# EAGLE schematic graphiclcd (EAGLE 4.16)
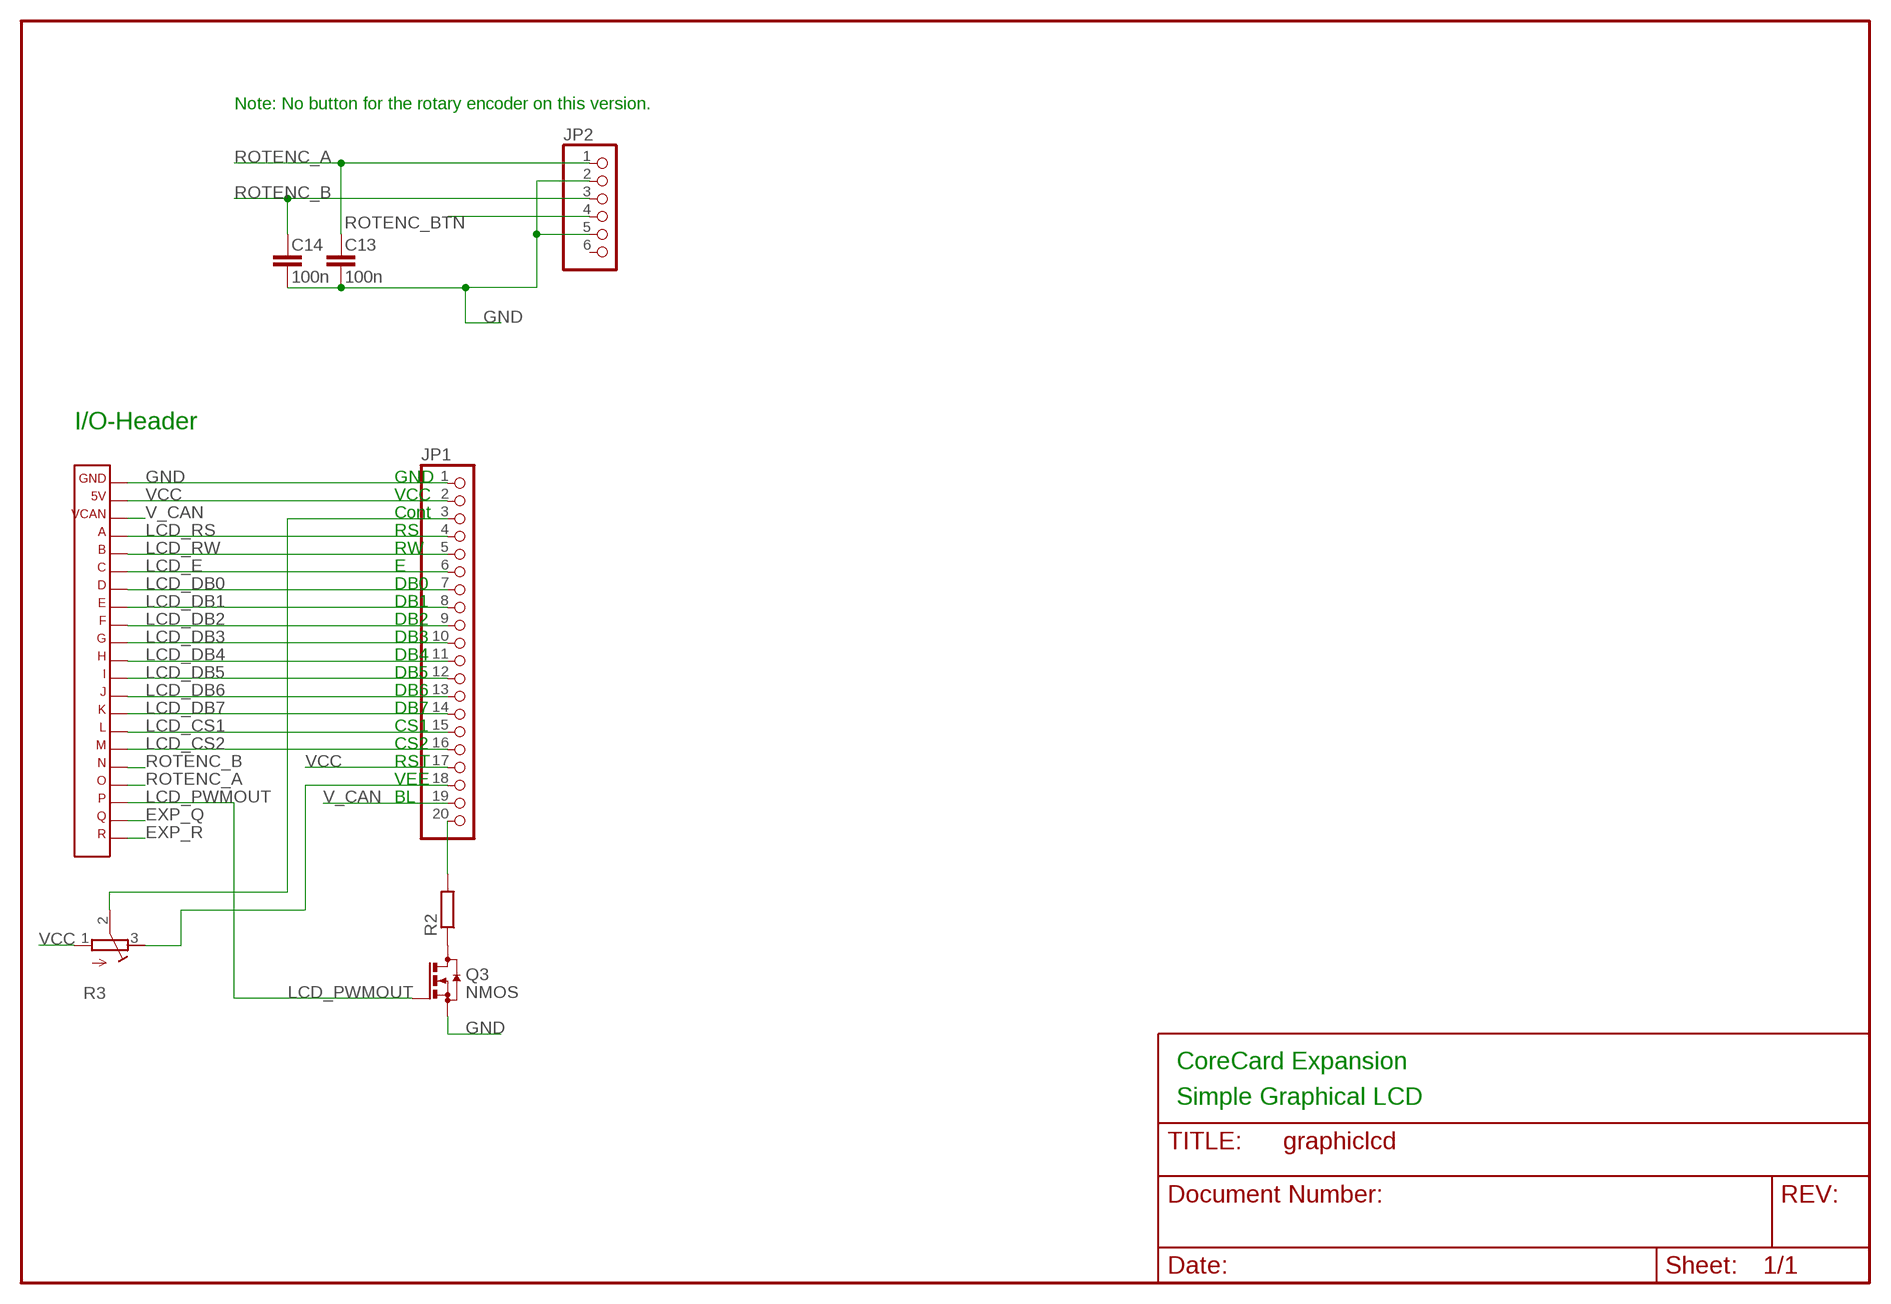
[diagram p0: schematic, sheet 1]

## Parts
C13  100n  C-EU  [C0603]
C14  100n  C-EU  [C0603]
JP1  PINHD-2X10  [2X10]
JP2  PINHD-2X03  [2X03]
Q3  NMOS  [SOT23]
R2  R-EU_0207/15  [0207/15]
R3  R-TRIM  [TRIM_PVZ3]
X3  CORE_IOHEADEXP  [CORE_IOHEAD_NOSILC]

## Nets
EXP_Q: X3.20
EXP_R: X3.21
GND: C13.2 C14.2 JP1.1 JP2.2 JP2.5 Q3.2(S) X3.1
LCD_CONTRAST: JP1.3 R3.2(PAD2)
LCD_CS1: JP1.15 X3.15
LCD_CS2: JP1.16 X3.16
LCD_DB0: JP1.7 X3.7
LCD_DB1: JP1.8 X3.8
LCD_DB2: JP1.9 X3.9
LCD_DB3: JP1.10 X3.10
LCD_DB4: JP1.11 X3.11
LCD_DB5: JP1.12 X3.12
LCD_DB6: JP1.13 X3.13
LCD_DB7: JP1.14 X3.14
LCD_E: JP1.6 X3.6
LCD_PWMOUT: Q3.1(G) X3.19
LCD_RS: JP1.4 X3.4
LCD_RW: JP1.5 X3.5
LCD_VEE: JP1.18 R3.3(PAD3)
N$1: Q3.3(D) R2.1
N$4: JP1.20 R2.2
ROTENC_A: C13.1 JP2.1 X3.18
ROTENC_B: C14.1 JP2.3 X3.17
ROTENC_BTN: JP2.4
V_CAN: JP1.19 X3.3
VCC: JP1.2 JP1.17 R3.1(PAD1) X3.2
Unconnected: JP2.6

## Notes on the sheet
- Note: No button for the rotary encoder on this version.
- I/O-Header
- GND
- VCC
- Cont
- RS
- RW
- E
- DB0
- DB1
- DB2
- DB3
- DB4
- DB5
- DB6
- DB7
- CS1
- CS2
- RST
- VEE
- BL
- CoreCard Expansion
- Simple Graphical LCD

## Library data of the parts
C13 C14 = rcl:C-EU
JP1 = pinhead-mm:PINHD-2X10
JP2 = pinhead-mm:PINHD-2X03
Q3 = transistor:NMOS
R2 = rcl:R-EU_: RESISTOR, European symbol
R3 = rcl:R-TRIM
X3 = expboard:CORE_IOHEAD: CoreCard IO-header for expansion cards